# Altium schematic sheet Transinstor_Booster.SchDoc: Title
size 431 x 279 mm; Date: *******; ApprovedBy: *******; CheckedBy: Dahami Fernando; Author: *******; CompanyName: *******; DrawnBy: Rivikula Fernando; Engineer: *******; Organization: *******; Address1: *******; Address2: *******; Address3: *******; Address4: *******; DocumentNumber: 3; Revision: *******; SheetNumber: 3; SheetTotal: 7; Subtitle: Transistor Booster; Project: Distotion_Gitar_Pedal; VersionRevision: 1; TotalSheet: 8; CurrentTime: *******; CurrentDate: *******; Time: *******; DocumentFullPathAndName: *******; DocumentName: *******; ModifiedDate: *******; ImagePath: *******; ProjectName: *******; Application_BuildNumber: *******
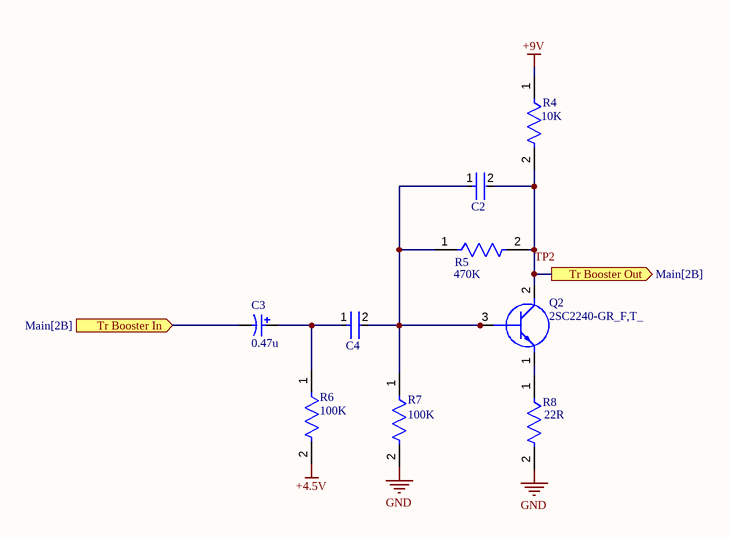
[diagram p0: Transinstor_Booster.SchDoc]

## Parts
C2  250p  [FP-RCE1A2-MFG]  (value not drawn)
C3  0.47u  [CAPPR55-200-1100X500X1200]
C4  47n  [FP-RCE1A2-MFG]  (value not drawn)
Q2  2SC2240-GR_F,T_  [SSM3K7002CFULF]
R4  10K  [FP-MRS1600-MFG]
R5  470K  [FP-MRS1600-MFG]
R6  100K  [FP-MRS1600-MFG]
R7  100K  [FP-MRS1600-MFG]
R8  22R  [FP-MRS1600-MFG]

## Ports
Tr Booster In (in, see Main[2B]), Tr Booster Out (out, see Main[2B])

## Nets
+4.5V: R6.2
+9V: R4.1
GND: R7.2 R8.2
TP2: C2.2 Q2.2(C) R4.2 R5.2 ; port Tr Booster Out
Tr Booster In: C3.2 ; port Tr Booster In
NetC2_1: C2.1 C4.2 Q2.3(B) R5.1 R7.1
NetC3_1: C3.1 C4.1 R6.1
NetQ2_1: Q2.1(E) R8.1

## Notes on the sheet
- DWG. NO.
- REV.
- SHT.
- THIS DOCUMENT AND THE DATA DISCLOSED HEREIN OR HEREWITH IS THE PROPERTY OF ALTIUM LIMITED AND MAY BE FREELY DISTRIBUTED IN WHOLE. NO RIGHTS ARE RESERVED OR EXPRESS OR IMPLIED WARANTEE GIVEN.
- REVISION
- DESCRIPTION
- DATE
- APPROVED
- ENG:
- APPROVALS
- PROJECT
- DSN:
- CHK:
- REFERENCE DOCUMENTS
- PROJECT REVISION:
- TITLE
- DOCUMENT REVISION:
- DESIGN ITEM:
- BOM:
- FAB DWG:
- PCB DWG:
- ASSY DWG:
- SCALE:
- SIZE
- B
- CAGE CODE
- FILE NAME
- DWG NO.
- SHEET
- OF
- REV

## Library data of the parts
C2 C4 = CMP-06035-023167-1: Cap Ceramic 100nF 100V X7R ±10% Radial 2.5mm +125°C Automotive Bulk; Lead Diameter: 0.5mm; Lead/Base Style: Straight; Resistor Type: Ceramic; Ratings: AEC-Q200; Mount: Through Hole; Termination: Radial; Capacitance: 100nF; Voltage Rating (DC): 100V; Max Operating Temperature: 125°C; Min Operating Temperature: -55°C; Case/Package: Radial; Tolerance: 10%; Length: 0.157inch; Voltage Rating: 100V; Width: 0.098inch; Packaging: Bulk; Package Quantity: 500; Lead Free: Lead Free; Height: 3.5mm; Dielectric: X7R; Height - Seated (Max): 0.138inch; Lead Pitch: 0.098inch
C3 = CMP-1665-00036-2: Aluminum Electrolytic Capacitor, 22 uF, +/- 20%, 50 V, -40 to 85 degC, 2-Pin THD, RoHS, Bulk; Manufacturer: Panasonic; Ripple Current: 100mA; Life (Hours): 2000Hour; Voltage: 50V; Dissipation Factor: 0.12%; Leakage Current: 3uA; Lead/Base Style: Straight; Capacitance: 22uF; Lead Diameter: 0.5mm; Max Operating Temperature: 85degC; Height: 11mm; Package Reference: CAPPR55-200-1100X500X1200; Radiation Hardening: No; RoHSCompliant: true; Termination: Radial; Case/Package: Radial; REACH SVHC: NoSVHC; Height - Seated (Max): 0.472inch; Min Operating Temperature: -40degC; Packaging: Bulk; Manufacturer URL: http://www.panasonic.com/; Length: 11mm; Tolerance: 20%; Voltage Rating: 50V; Voltage Rating (DC): 50V; Datasheet URL: https://industrial.panasonic.com/cdbs/www-data/pdf/RDF0000/ABA0000C1218.pdf; Lead Pitch: 2mm; Ripple Current (AC): 100mA; Package Description: 2-Pin Radial Lead, Dia 5 mm, Height 12 mm; Diameter: 5mm; Datasheet Version: Rev. 05, 10/2016; Package Quantity: 200; Mount: ThroughHole
Q2 = 2SC2240-GR_F,T_: Transistor BJT NPN; Manufacturer_Name: Toshiba; Manufacturer_Part_Number: 2SC2240-GR(F,T); Datasheet Link: https://datasheet.octopart.com/2SC2240GR-Toshiba-datasheet-109832.pdf; Mouser Part Number: 757-2SC2240-GRFT; Mouser Price/Stock: https://www.mouser.co.uk/ProductDetail/Toshiba/2SC2240-GRFT?qs=%2FsslhGPpiOR3XjNwkR44HA%3D%3D
R4-R8 = CMP-02408-000019-1: RES 20K OHM 0.4W 1% AXIAL; Max Power Dissipation: 400mW; Temperature Coefficient: 50ppm/°C; Resistance: 20kR; Technology: THIN FILM; Max Operating Temperature: 155°C; Number of Terminations: 2; RoHS Compliant: Yes; Packaging: Tape and Reel; Radiation Hardening: No; Contact Plating: Tin; Military Standard: Not; Construction: Cylindrical; Diameter: 1.6mm; Tolerance: 1%; Mount: Through Hole; Power Rating: 400mW; Case/Package: Conformal; Termination: Axial; Length: 3.6mm; Min Operating Temperature: -55°C; Resistor Type: Metal Film; Series: MRS16